# EAGLE design DCF_AD8403_Shield (EAGLE 7.2.0)
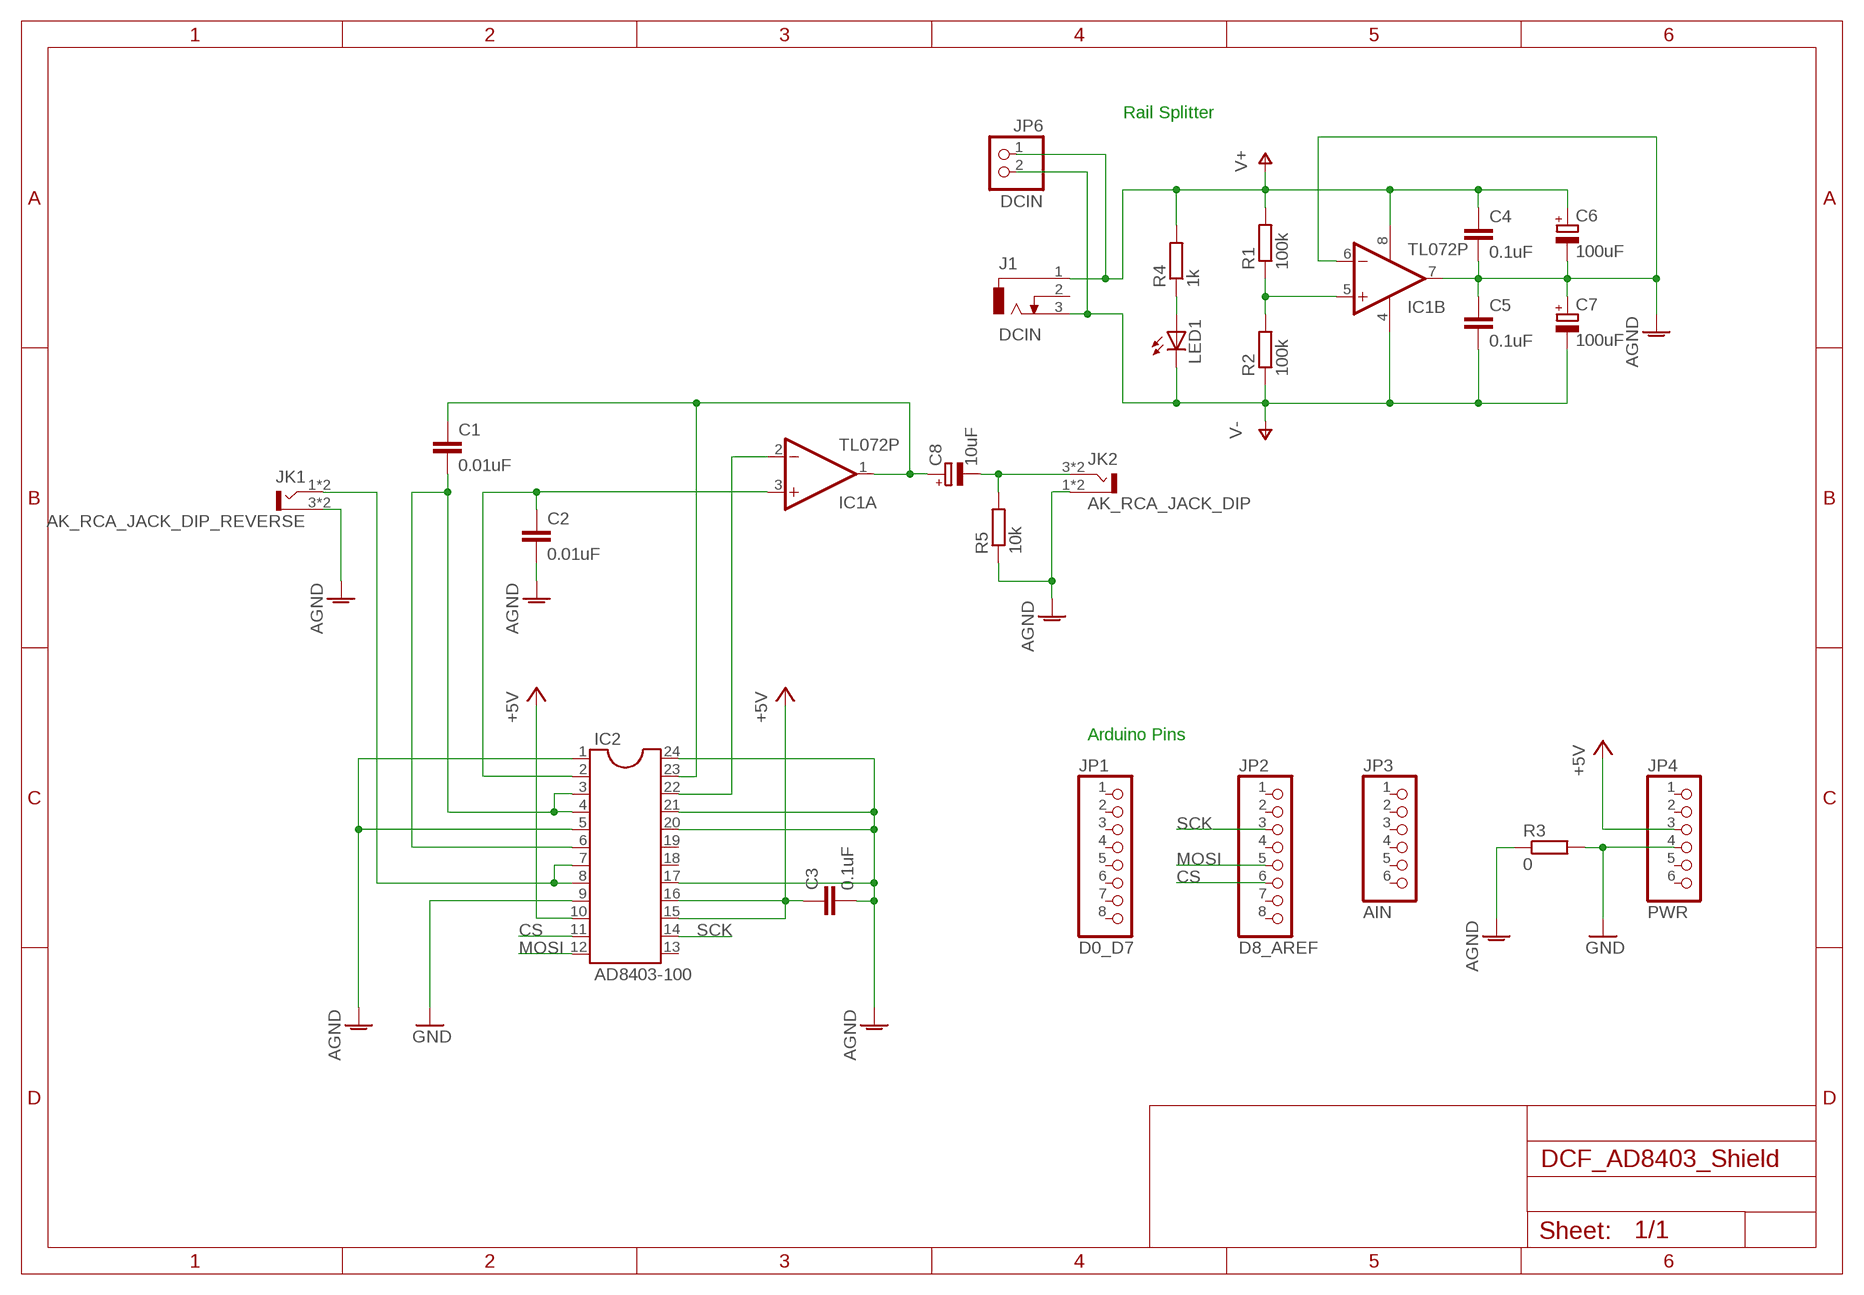
[diagram p0: schematic, sheet 1]

## Parts
C1  0.01uF  C-EU075-032X103  [C075-032X103]
C2  0.01uF  C-EU075-032X103  [C075-032X103]
C3  0.1uF  C-EU025-024X044  [C025-024X044]
C4  0.1uF  C-EU025-024X044  [C025-024X044]
C5  0.1uF  C-EU025-024X044  [C025-024X044]
C6  100uF  CPOL-EUE2.5-6  [E2,5-6]
C7  100uF  CPOL-EUE2.5-6  [E2,5-6]
C8  10uF  CPOL-EUE5-6  [E5-6]
IC1  TL072P  [DIL08]
IC2  AD8403-100  DIL24-6  [DIL24-6]
J1  DCIN  DCJ0303  [DCJ0303]
JK1  AK_RCA_JACK_DIP_REVERSE  [AK_RCA_JACK_DIP]
JK2  AK_RCA_JACK_DIP  [AK_RCA_JACK_DIP]
JP1  D0_D7  PINHD-1X8  [1X08]
JP2  D8_AREF  PINHD-1X8  [1X08]
JP3  AIN  PINHD-1X6  [1X06]
JP4  PWR  PINHD-1X6  [1X06]
JP6  DCIN  PINHD-1X2  [1X02]
LED1  LED3MM  [LED3MM]
R1  100k  R-EU_0207/7  [0207/7]
R2  100k  R-EU_0207/7  [0207/7]
R3  0  R-EU_0207/7  [0207/7]
R4  1k  R-EU_0204/7  [0204/7]
R5  10k  R-EU_0204/7  [0204/7]

## Nets
+5V: C3.1 IC2.10 IC2.15 IC2.16 JP4.3
AGND: C2.2 C3.2 C4.2 C5.1 C6.- C7.+ IC1.6(B:-IN) IC1.7(B:OUT) IC2.1 IC2.5 IC2.17 IC2.20 IC2.21 IC2.24 JK1.3(S) JK1.4(S) JK2.1(S) JK2.2(S) R3.1 R5.1
BYPASS: IC2.7 IC2.8 JK1.1(T) JK1.2(T)
CS: IC2.11 JP2.6
FILTERED: C1.1 C8.+ IC1.1(A:OUT) IC2.23
GND: IC2.9 JP4.4 R3.2
MOSI: IC2.12 JP2.5
N$1: IC1.2(A:-IN) IC2.22
N$2: LED1.A R4.1
N$3: C8.- JK2.3(T) JK2.4(T) R5.2
N$5: IC1.5(B:+IN) R1.1 R2.2
N$6: C1.2 IC2.3 IC2.4 IC2.6
N$8: C2.1 IC1.3(A:+IN) IC2.2
SCK: IC2.14 JP2.3
V+: C4.1 C6.+ IC1.8(P:V+) J1.1 JP6.1 R1.2 R4.2
V-: C5.2 C7.- IC1.4(P:V-) J1.3 JP6.2 LED1.K(C) R2.1
Unconnected: IC2.13 IC2.18 IC2.19 J1.2 JP1.1 JP1.2 JP1.3 JP1.4 JP1.5 JP1.6 JP1.7 JP1.8 JP2.1 JP2.2 JP2.4 JP2.7 JP2.8 JP3.1 JP3.2 JP3.3 JP3.4 JP3.5 JP3.6 JP4.1 JP4.2 JP4.5 JP4.6

## Notes on the sheet
- Rail Splitter
- Arduino Pins

## Library data of the parts
C1-C5 = rcl:C-EU: CAPACITOR, European symbol
C6-C8 = rcl:CPOL-EU: POLARIZED CAPACITOR, European symbol
IC1 = linear:TL072: OP AMP
IC2 = ic-package:DIL24: Dual In Line
J1 = con-jack:DCJ0303: DC POWER JACK Source: DCJ0303.pdf; OC_FARNELL: unknown; OC_NEWARK: unknown
JK1 = mylib2:AK_RCA_JACK_DIP_REVERSE: 秋月RCAジャックDIP化キット 基板裏表逆
JK2 = mylib2:AK_RCA_JACK_DIP: 秋月RCAジャックDIP化キット
JP1 JP2 = pinhead:PINHD-1X8: PIN HEADER
JP3 JP4 = pinhead:PINHD-1X6: PIN HEADER
JP6 = pinhead:PINHD-1X2: PIN HEADER
LED1 = led:LED: LED OSRAM: - CHIPLED LG R971, LG N971, LY N971, LG Q971, LY Q971, LO R971, LY R971 LH N974, LH R974 LS Q976, LO Q976, LY Q976 LO Q996 - Hyper CHIPLED LW Q18S LB Q993, LB Q99A, LB R99A - SideLED LS A670, LO A670, LY A670, LG A670, LP A670 LB A673, LV A673, LT A673, LW A673 LH A674 LY A675 LS A676, LA A676, LO A676, LY A676, LW A676 LS A679, LY A679, LG A679 - Hyper Micro SIDELED® LS Y876, LA Y876, LO Y876, LY Y876 LT Y87S - SmartLED LW L88C, LW L88S LB L89C, LB L89S, LG L890 LS L89K, LO L89K, LY L89K LS L896, LA L896, LO L896, LY L896 - TOPLED LS T670, LO T670, LY T670, LG T670, LP T670 LSG T670, LSP T670, LSY T670, LOP T670, LYG T670 LG T671, LOG T671, LSG T671 LB T673, LV T673, LT T673, LW T673 LH T674 LS T676, LA T676, LO T676, LY T676, LB T676, LH T676, LSB T676, LW T676 LB T67C, LV T67C, LT T67C, LS T67K, LO T67K, LY T67K, LW E67C LS E67B, LA E67B, LO E67B, LY E67B, LB E67C, LV E67C, LT E67C LW T67C LS T679, LY T679, LG T679 LS T770, LO T770, LY T770, LG T770, LP T770 LB T773, LV T773, LT T773, LW T773 LH T774 LS E675, LA E675, LY E675, LS T675 LS T776, LA T776, LO T776, LY T776, LB T776 LHGB T686 LT T68C, LB T68C - Hyper Mini TOPLED® LB M676 - Mini TOPLED Santana® LG M470 LS M47K, LO M47K, LY M47K Source: http://www.osram.convergy.de LUXEON: - LUMILED® LXK2-PW12-R00, LXK2-PW12-S00, LXK2-PW14-U00, LXK2-PW14-V00 LXK2-PM12-R00, LXK2-PM12-S00, LXK2-PM14-U00 LXK2-PE12-Q00, LXK2-PE12-R00, LXK2-PE12-S00, LXK2-PE14-T00, LXK2-PE14-U00 LXK2-PB12-K00, LXK2-PB12-L00, LXK2-PB12-M00, LXK2-PB14-N00, LXK2-PB14-P00, LXK2-PB14-Q00 LXK2-PR12-L00, LXK2-PR12-M00, LXK2-PR14-Q00, LXK2-PR14-R00 LXK2-PD12-Q00, LXK2-PD12-R00, LXK2-PD12-S00 LXK2-PH12-R00, LXK2-PH12-S00 LXK2-PL12-P00, LXK2-PL12-Q00, LXK2-PL12-R00 Source: www.luxeon.com KINGBRIGHT: KA-3528ASYC Source: www.kingbright.com
R1-R5 = rcl:R-EU_: RESISTOR, European symbol

## Board
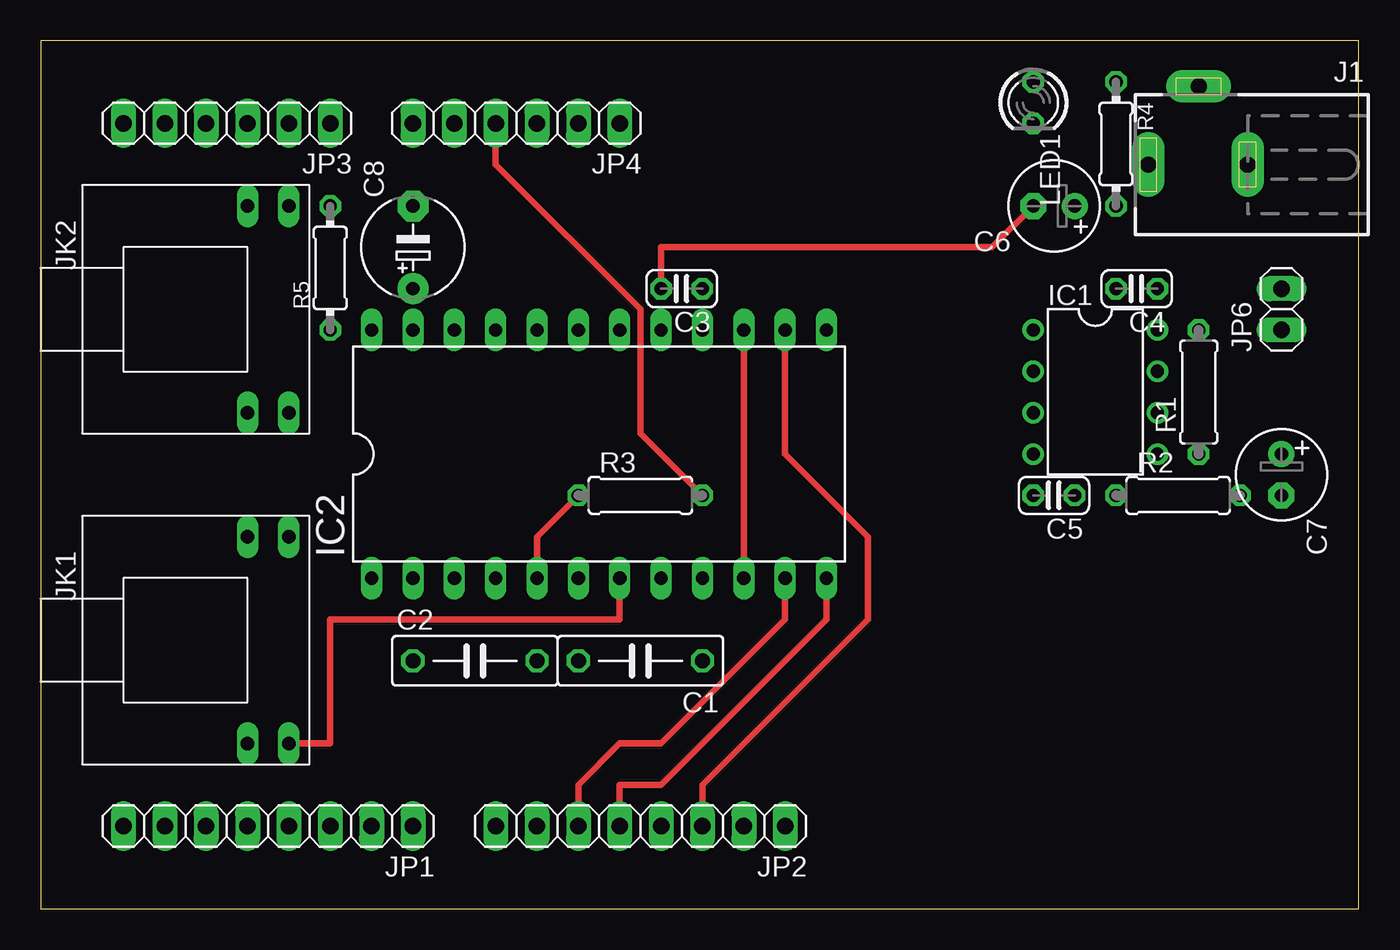
[diagram p1: board, top side]
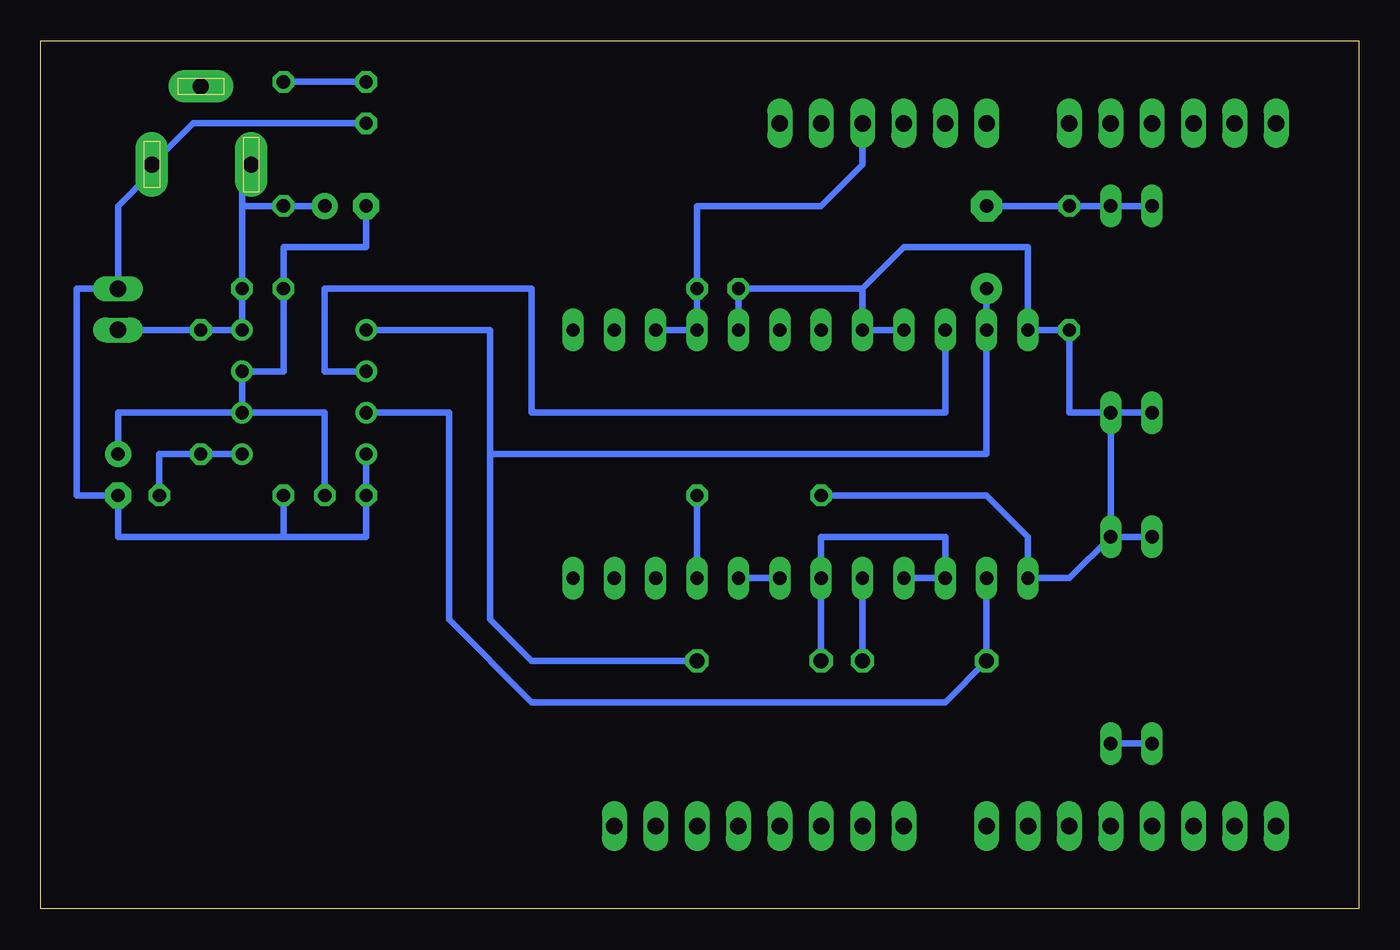
[diagram p2: board, bottom side, seen from below]

Size 80.95 x 53.33 mm. Coordinates in mm from the lower left corner, seen from the top.
Outline: 0,0 80.95,0 80.95,53.33 0,53.33 0,0
Copper layers (1*16): Top 0.035mm / dielectric 1.5mm / Bottom 0.035mm
Design rules "default": minimum track width 10mil, minimum drill 24mil, track to track 8mil, track to pad 8mil, pad to pad 8mil, via to via 8mil, smd to smd 8mil, copper to edge 40mil, drill to drill 8mil, minimum pad ring 10mil, minimum via ring 8mil, stop-mask expansion 4mil, vias tented up to drill 0mil, thermal gap 10mil

### Footprints (pad centres in the part's own frame; a part is rotated, then mirrored left to right if it is on the bottom)
C075-032X103 = drill 0.914 octagon: 1 -3.81,0; 2 3.81,0
C025-024X044 = drill 0.813 octagon: 1 -1.27,0; 2 1.27,0
E2,5-6 = drill 0.813 pad 1.6: + -1.27,0 | drill 0.813 pad 1.6 octagon: - 1.27,0
E5-6 = drill 0.813 pad 1.905: + -2.54,0 | drill 0.813 pad 1.905 octagon: - 2.54,0
DIL08 = drill 0.813 pad 1.27: 1 -3.81,-3.81; 2 -1.27,-3.81; 3 1.27,-3.81; 4 3.81,-3.81; 5 3.81,3.81; 6 1.27,3.81; 7 -1.27,3.81; 8 -3.81,3.81
DIL24-6 = drill 0.813 long: 1 -13.97,-7.62; 2 -11.43,-7.62; 3 -8.89,-7.62; 4 -6.35,-7.62; 5 -3.81,-7.62; 6 -1.27,-7.62; 7 1.27,-7.62; 8 3.81,-7.62; 9 6.35,-7.62; 10 8.89,-7.62; 11 11.43,-7.62; 12 13.97,-7.62; 13 13.97,7.62; 14 11.43,7.62; 15 8.89,7.62; 16 6.35,7.62; 17 3.81,7.62; 18 1.27,7.62; 19 -1.27,7.62; 20 -3.81,7.62; 21 -6.35,7.62; 22 -8.89,7.62; 23 -11.43,7.62; 24 -13.97,7.62
DCJ0303 = drill 1 pad 2 long: 1 0,3.1; 2 4.8,0; 3 0,-3
AK_RCA_JACK_DIP = drill 0.813 long: 1 10.16,0; 2 12.7,0; 3 12.7,12.7; 4 10.16,12.7
1X08 = drill 1.016 long: 1 -8.89,0; 2 -6.35,0; 3 -3.81,0; 4 -1.27,0; 5 1.27,0; 6 3.81,0; 7 6.35,0; 8 8.89,0
1X06 = drill 1.016 long: 1 -6.35,0; 2 -3.81,0; 3 -1.27,0; 4 1.27,0; 5 3.81,0; 6 6.35,0
1X02 = drill 1.016 long: 1 -1.27,0; 2 1.27,0
LED3MM = drill 0.813 octagon: A -1.27,0; K 1.27,0
0207/7 = drill 0.813 octagon: 1 -3.81,0; 2 3.81,0
0204/7 = drill 0.813 octagon: 1 -3.81,0; 2 3.81,0

### Placement (x,y rotation side)
C1  36.83,15.24 180 top
C2  26.67,15.24 0 top
C3  39.37,38.1 180 top
C4  67.31,38.1 180 top
C5  62.23,25.4 180 top
C6  62.23,43.18 180 top
C7  76.2,26.67 270 top
C8  22.86,40.64 90 top
IC1  64.77,31.75 270 top
IC2  34.29,27.94 0 top
J1  71.12,45.72 90 top
JK1  2.54,10.16 0 top
JK2  2.54,30.48 0 top
JP1  13.97,5.08 180 top
JP2  36.83,5.08 180 top
JP3  11.43,48.26 180 top
JP4  29.21,48.26 180 top
JP6  76.2,36.83 90 top
LED1  60.96,49.53 270 top
R1  71.12,31.75 90 top
R2  69.85,25.4 0 top
R3  36.83,25.4 0 top
R4  66.04,46.99 270 top
R5  17.78,39.37 90 top

### Tracks (layer width: path | path; a pad name or v marks a point on that pad's centre or on a via)
+5V
  Top 0.406: IC2.15 IC2.10
  Bottom 0.406: IC2.15 IC2.16 C3.1 40.64,43.18 33.02,43.18 30.48,45.72 JP4.3
AGND
  Top 0.406: IC2.5 30.48,22.86 R3.1 | C3.2 38.1,40.64 58.42,40.64 C6.-
  Bottom 0.406: JK2.1 JK2.2 | JK1.4 JK1.3 | JK2.2 JK1.3 | JK1.3 17.78,20.32 IC2.1 20.32,22.86 22.86,25.4 R3.1 | IC2.5 C2.2 | IC2.21 IC2.20 30.48,38.1 | IC1.6 IC1.7 66.04,33.02 C4.2 66.04,40.64 60.96,40.64 C6.- | IC2.17 C3.2 30.48,38.1 | 30.48,38.1 27.94,40.64 20.32,40.64 IC2.24 R5.1 17.78,30.48 JK2.2 | IC1.6 76.2,30.48 C7.+ | C5.1 63.5,30.48 IC1.6
BYPASS
  Top 0.406: IC2.7 35.56,17.78 17.78,17.78 17.78,10.16 JK1.2
  Bottom 0.406: JK1.1 JK1.2 | IC2.7 IC2.8
CS
  Top 0.406: JP2.6 33.02,7.62 35.56,10.16 38.1,10.16 45.72,17.78 IC2.11
FILTERED
  Bottom 0.406: 53.34,27.94 22.86,27.94 IC2.23 C8.+ | C1.1 50.8,15.24 53.34,17.78 53.34,27.94 | 53.34,27.94 53.34,35.56 IC1.1
GND
  Top 0.406: JP4.4 27.94,45.72 36.83,36.83 36.83,29.21 R3.2
  Bottom 0.406: IC2.9 R3.2
MOSI
  Top 0.406: JP2.5 35.56,7.62 38.1,7.62 48.26,17.78 IC2.12
N$1
  Bottom 0.406: IC2.22 25.4,30.48 50.8,30.48 50.8,38.1 63.5,38.1 63.5,33.02 IC1.2
N$2
  Bottom 0.406: LED1.A R4.1
N$3
  Bottom 0.406: JK2.4 JK2.3 R5.2 C8.-
N$5
  Bottom 0.406: R2.2 73.66,27.94 R1.1 IC1.5
N$6
  Bottom 0.406: C1.2 IC2.6 33.02,22.86 25.4,22.86 IC2.3 IC2.4
N$8
  Bottom 0.406: IC2.2 C2.1 25.4,12.7 50.8,12.7 55.88,17.78 55.88,30.48 IC1.3
SCK
  Top 0.406: JP2.3 40.64,7.62 50.8,17.78 50.8,22.86 45.72,27.94 IC2.14
V+
  Bottom 0.406: C6.+ R4.2 68.58,43.18 | 68.58,43.18 68.58,45.16 J1.1 | JP6.1 R1.2 IC1.8 C4.1 68.58,43.18
V-
  Bottom 0.406: LED1.K 71.58,48.26 J1.3 74.12,45.26 76.2,43.18 JP6.2 78.74,38.1 78.74,25.4 C7.- 76.2,22.86 66.04,22.86 | 66.04,22.86 60.96,22.86 C5.2 IC1.4 | 66.04,22.86 R2.1

### Text on the board
tDocu: 18 Holes (+1Hole / +1Hole) x 30 Holes (23 Holes + 7 Holes)